# EAGLE board pcb (1) (EAGLE 9.6.2)
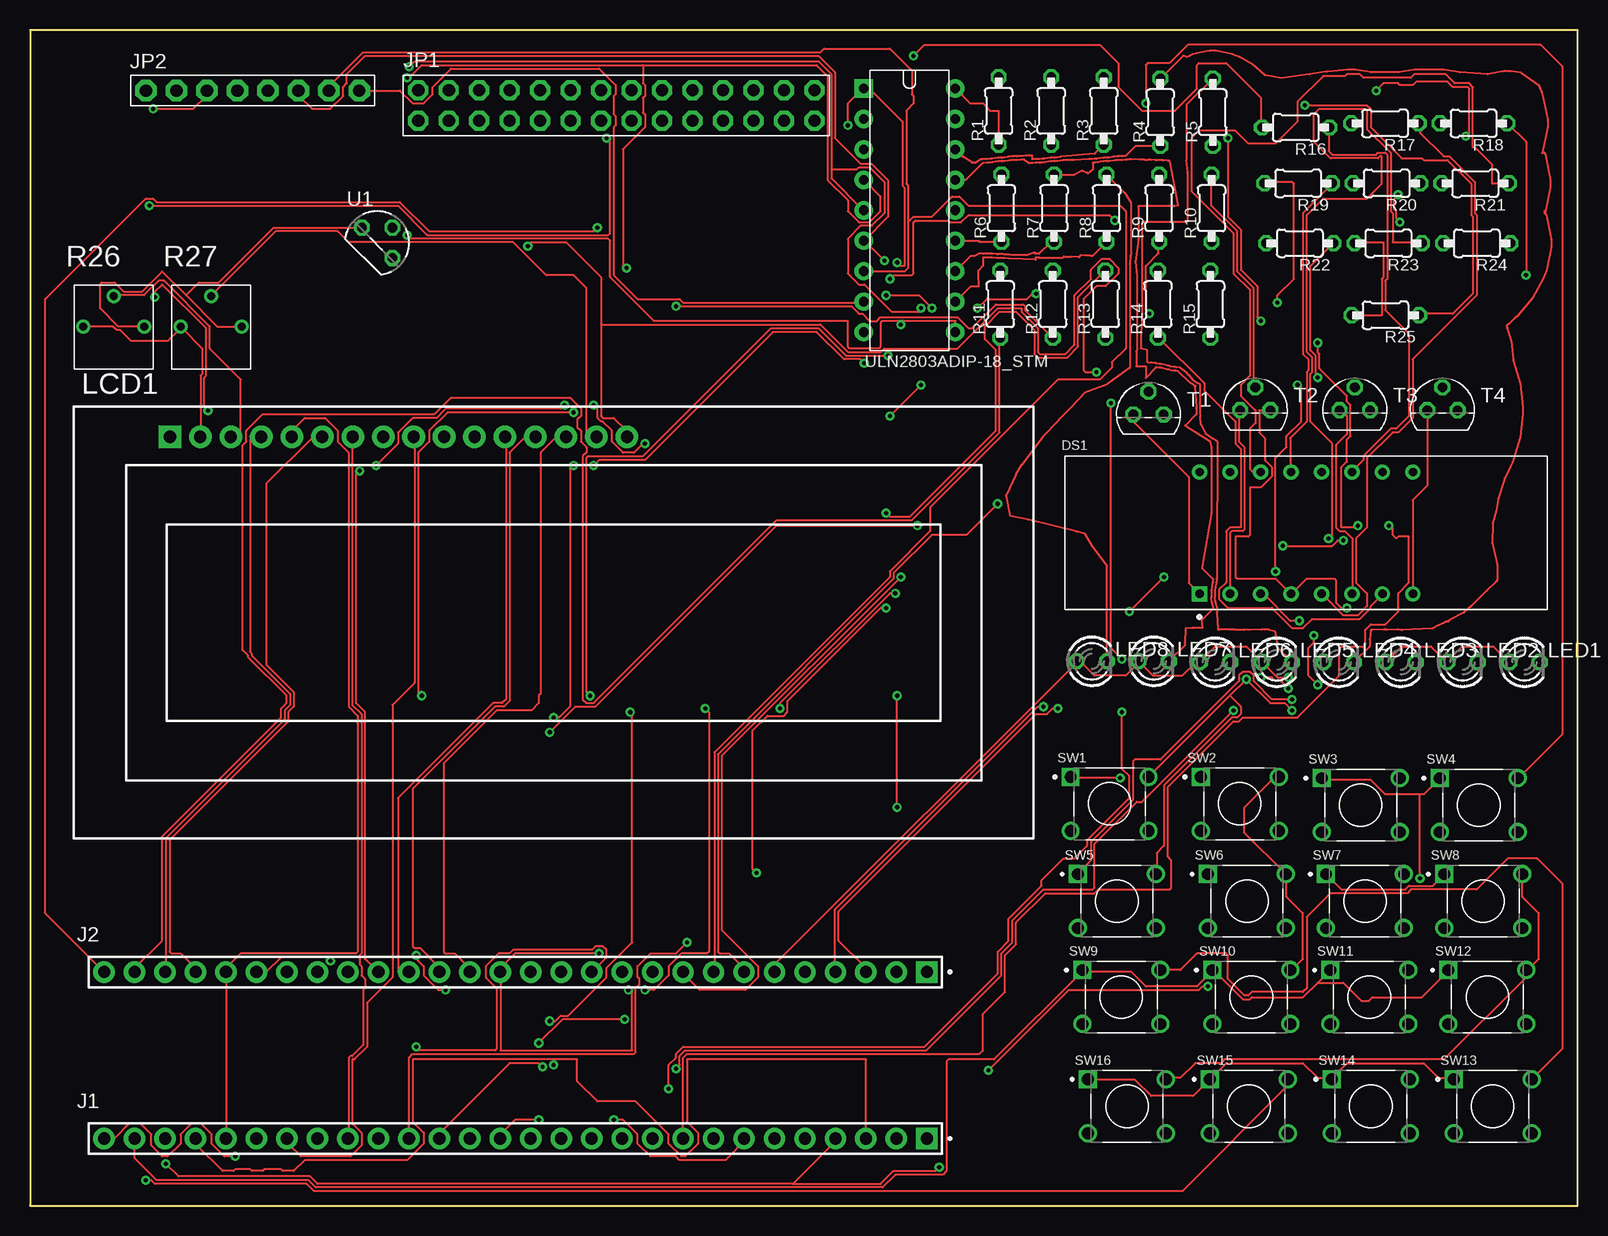
[diagram p1: board, top side]
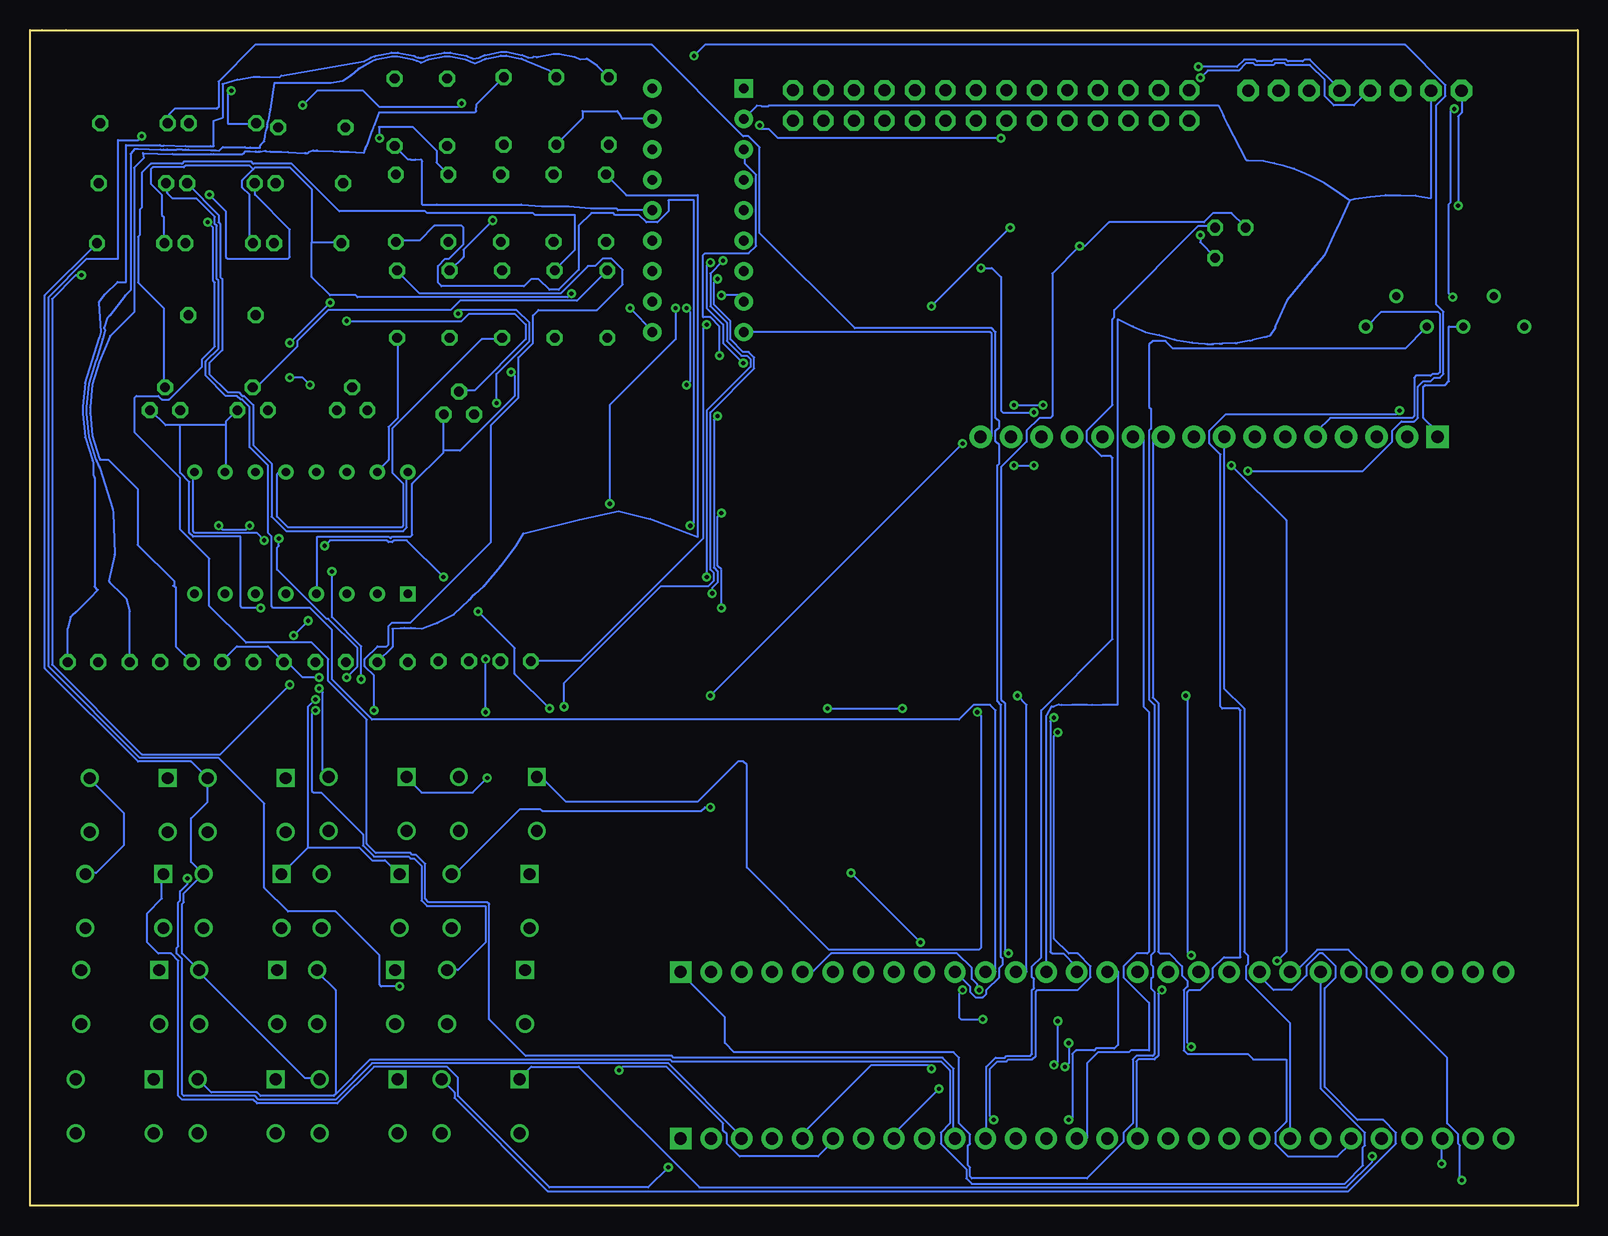
[diagram p2: board, bottom side, seen from below]

Size 129 x 98 mm. Coordinates in mm from the lower left corner, seen from the top.
Outline: 128,98 126,98 0,98 0,0 129,0 129,98 128,98
Copper layers (1*16): Top 0.035mm / dielectric 1.5mm / Bottom 0.035mm
Design rules "default": minimum track width 6mil, minimum drill 0.35mm, track to track 6mil, track to pad 6mil, pad to pad 6mil, via to via 6mil, smd to smd 6mil, copper to edge 40mil, drill to drill 6mil, minimum pad ring 10mil, minimum via ring 8mil, stop-mask expansion 4mil, vias tented up to drill 0mil, thermal gap 10mil

## Footprints (pad centres in the part's own frame; a part is rotated, then mirrored left to right if it is on the bottom)
DISPLAY_TDCG1060M = drill 0.7 pad 1.27 square: 1 -8.89,-5.08 | drill 0.7 pad 1.27: 2 -6.35,-5.08; 3 -3.81,-5.08; 4 -1.27,-5.08; 5 1.27,-5.08; 6 3.81,-5.08; 7 6.35,-5.08; 8 8.89,-5.08; 9 8.89,5.08; 10 6.35,5.08; 11 3.81,5.08; 12 1.27,5.08; 13 -1.27,5.08; 14 -3.81,5.08; 15 -6.35,5.08; 16 -8.89,5.08
DIP-18_STM = drill 0.813 pad 1.524 square: 1 0,0 | drill 0.813 pad 1.524: 2 0,-2.54; 3 0,-5.08; 4 0,-7.62; 5 0,-10.16; 6 0,-12.7; 7 0,-15.24; 8 0,-17.78; 9 0,-20.32; 10 7.62,-20.32; 11 7.62,-17.78; 12 7.62,-15.24; 13 7.62,-12.7; 14 7.62,-10.16; 15 7.62,-7.62; 16 7.62,-5.08; 17 7.62,-2.54; 18 7.62,0
SAMTEC_SS-128-T-2 = drill 1.016 pad 1.778 square: 01 0,0 | drill 1.016 pad 1.778: 02 -2.54,0; 03 -5.08,0; 04 -7.62,0; 05 -10.16,0; 06 -12.7,0; 07 -15.24,0; 08 -17.78,0; 09 -20.32,0; 10 -22.86,0; 11 -25.4,0; 12 -27.94,0; 13 -30.48,0; 14 -33.02,0; 15 -35.56,0; 16 -38.1,0; 17 -40.64,0; 18 -43.18,0; 19 -45.72,0; 20 -48.26,0; 21 -50.8,0; 22 -53.34,0; 23 -55.88,0; 24 -58.42,0; 25 -60.96,0; 26 -63.5,0; 27 -66.04,0; 28 -68.58,0
2X14-BIG = drill 1.016 pad 1.676 octagon: 1 -16.51,-1.27; 2 -16.51,1.27; 3 -13.97,-1.27; 4 -13.97,1.27; 5 -11.43,-1.27; 6 -11.43,1.27; 7 -8.89,-1.27; 8 -8.89,1.27; 9 -6.35,-1.27; 10 -6.35,1.27; 11 -3.81,-1.27; 12 -3.81,1.27; 13 -1.27,-1.27; 14 -1.27,1.27; 15 1.27,-1.27; 16 1.27,1.27; 17 3.81,-1.27; 18 3.81,1.27; 19 6.35,-1.27; 20 6.35,1.27; 21 8.89,-1.27; 22 8.89,1.27; 23 11.43,-1.27; 24 11.43,1.27; 25 13.97,-1.27; 26 13.97,1.27; 27 16.51,-1.27; 28 16.51,1.27
1X08-BIG = drill 1.016 pad 1.778 octagon: 1 -8.89,0; 2 -6.35,0; 3 -3.81,0; 4 -1.27,0; 5 1.27,0; 6 3.81,0; 7 6.35,0; 8 8.89,0
LCD-16X2_NOHOLESNOSILK = drill 1.016 pad 1.88 square: 1 -32,15.5 | drill 1.016 pad 1.88: 2 -29.46,15.5; 3 -26.92,15.5; 4 -24.38,15.5; 5 -21.84,15.5; 6 -19.3,15.5; 7 -16.76,15.5; 8 -14.22,15.5; 9 -11.68,15.5; 10 -9.14,15.5; 11 -6.6,15.5; 12 -4.06,15.5; 13 -1.52,15.5; 14 1.02,15.5; 15 3.56,15.5; 16 6.1,15.5
LED3MM = drill 0.813 octagon: A -1.27,0; K 1.27,0
0207/10 = drill 0.813 octagon: 1 -1.54,0; 2 4.08,0
3362P-1-103LF = drill 0.66: 1 -2.54,0; 2 0,2.54; 3 2.54,0
TE_1825910-2 = drill 0.99 square: 1 0,0 | drill 0.99: 2 6.5,0; 3 0,-4.5; 4 6.5,-4.5
TO92 = drill 0.813 octagon: 1 1.27,0; 2 0,1.905; 3 -1.27,0
TO92/ = drill 0.813 octagon: 1 1.27,-1.27; 2 1.27,1.27; 3 -1.27,1.27

## Placement (x,y rotation side)
DS1  TDCG1060M  [DISPLAY_TDCG1060M]  106.39,56.07 0 top
IC1  ULN2803ADIP-18_STM  [DIP-18_STM]  69.51,93.13 0 top
J1  SS-128-T-2  [SAMTEC_SS-128-T-2]  74.76,5.58 0 top
J2  SS-128-T-2  [SAMTEC_SS-128-T-2]  74.76,19.47 0 top
JP1  [2X14-BIG]  48.88,91.71 0 top
JP2  [1X08-BIG]  18.56,92.95 0 top
LCD1  LCD-16X2NOHOLES  [LCD-16X2_NOHOLESNOSILK]  43.66,48.59 0 top
LED1  [LED3MM]  124.58,45.3 0 top
LED2  [LED3MM]  119.42,45.3 0 top
LED3  [LED3MM]  114.26,45.3 0 top
LED4  [LED3MM]  109.1,45.3 0 top
LED5  [LED3MM]  103.94,45.3 0 top
LED6  [LED3MM]  98.78,45.3 0 top
LED7  [LED3MM]  93.68,45.38 0 top
LED8  [LED3MM]  88.52,45.38 0 top
R1  R-US  [0207/10]  80.75,89.98 90 top
R2  R-US  [0207/10]  85.13,89.98 90 top
R3  R-US  [0207/10]  89.51,89.98 90 top
R4  R-US  [0207/10]  94.22,89.87 90 top
R5  R-US  [0207/10]  98.6,89.87 90 top
R6  R-US  [0207/10]  80.98,81.87 90 top
R7  R-US  [0207/10]  85.36,81.87 90 top
R8  R-US  [0207/10]  89.74,81.87 90 top
R9  R-US  [0207/10]  94.12,81.87 90 top
R10  R-US  [0207/10]  98.5,81.87 90 top
R11  R-US  [0207/10]  80.88,73.87 90 top
R12  R-US  [0207/10]  85.26,73.87 90 top
R13  R-US  [0207/10]  89.64,73.87 90 top
R14  R-US  [0207/10]  94.02,73.87 90 top
R15  R-US  [0207/10]  98.4,73.87 90 top
R16  R-US  [0207/10]  106.78,89.87 180 top
R17  R-US  [0207/10]  114.22,90.22 180 top
R18  R-US  [0207/10]  121.6,90.22 180 top
R19  R-US  [0207/10]  106.98,85.22 180 top
R20  R-US  [0207/10]  114.36,85.22 180 top
R21  R-US  [0207/10]  121.74,85.22 180 top
R22  R-US  [0207/10]  107.12,80.22 180 top
R23  R-US  [0207/10]  114.5,80.22 180 top
R24  R-US  [0207/10]  121.88,80.22 180 top
R25  R-US  [0207/10]  114.26,74.22 180 top
R26  [3362P-1-103LF]  6.99,73.26 0 top
R27  [3362P-1-103LF]  15.1,73.26 0 top
SW1  1825910-2  [TE_1825910-2]  86.75,35.74 0 top
SW2  1825910-2  [TE_1825910-2]  97.59,35.74 0 top
SW3  1825910-2  [TE_1825910-2]  107.68,35.63 0 top
SW4  1825910-2  [TE_1825910-2]  117.52,35.63 0 top
SW5  1825910-2  [TE_1825910-2]  87.36,27.63 0 top
SW6  1825910-2  [TE_1825910-2]  98.2,27.63 0 top
SW7  1825910-2  [TE_1825910-2]  108.04,27.63 0 top
SW8  1825910-2  [TE_1825910-2]  117.88,27.63 0 top
SW9  1825910-2  [TE_1825910-2]  87.72,19.63 0 top
SW10  1825910-2  [TE_1825910-2]  98.56,19.63 0 top
SW11  1825910-2  [TE_1825910-2]  108.4,19.63 0 top
SW12  1825910-2  [TE_1825910-2]  118.24,19.63 0 top
SW13  1825910-2  [TE_1825910-2]  118.68,10.52 0 top
SW14  1825910-2  [TE_1825910-2]  108.52,10.52 0 top
SW15  1825910-2  [TE_1825910-2]  98.36,10.52 0 top
SW16  1825910-2  [TE_1825910-2]  88.2,10.52 0 top
T1  BC547  [TO92]  93.24,65.95 0 top
T2  BC547  [TO92]  102.14,66.3 0 top
T3  BC547  [TO92]  110.44,66.3 0 top
T4  BC547  [TO92]  117.74,66.3 0 top
U1  LM60CIZ  [TO92/]  28.94,80.26 0 top

## Tracks (layer width: path | path; a pad name or v marks a point on that pad's centre or on a via)
GND  (via drill 0.35)
  Top 0.152: v42.41,7.14 40.43,7.14 39.22,5.92 39.22,5.62 J1.15 | v49.88,17.96 50.03,17.96 50.19,17.81 50.19,12.94 39.22,12.94 39.22,19.34 J2.15 39.22,19.49 39.22,19.79 40.43,21.01 v47.44,21.01 | T2.1 103.38,66.28 102.46,66.28 102.46,64.45 102.92,63.99 102.92,62.16 103.53,61.55 103.53,60.79 102.61,59.87 101.7,59.87 101.7,55.91 101.55,55.76 100.48,55.76 100.48,52.41 100.63,52.25 103.83,52.25 105.05,51.03 DS1.4 105.2,51.03 106.42,52.25 108.71,52.25 108.86,52.1 108.86,50.27 109.32,49.82 v109.78,49.82 | J1.24 16.36,5.62 16.36,19.34 J2.24 16.36,19.49 16.36,19.79 17.57,21.01 27.18,21.01 27.33,21.16 27.33,40.82 26.57,41.59 26.57,62.77 25.65,63.68 25.65,64.6 24.58,65.67 22.91,65.67 21.84,64.6 21.84,64.14 LCD1.5 | 13,75.88 11.02,77.86 9.34,76.18 7.82,76.18 7.06,76.94 5.99,76.94 5.84,76.79 5.84,74.81 7.36,73.29 9.5,73.29 R26.3 | 13,75.88 15.59,73.29 17.57,73.29 R27.3 | 13,75.88 14.07,76.94 15.75,76.94 20.32,81.52 27.63,81.52 U1.3 | 47.6,73.44 47.6,77.4 44.7,80.3 41.81,80.3 v41.5,79.99 | 47.6,73.44 47.6,65.82 47.75,65.67 48.66,65.67 49.73,64.6 49.73,64.14 LCD1.16 | v88.9,69.48 87.98,69.48 87.83,69.63 87.83,75.57 88.9,76.64 89.66,76.64 90.73,77.7 90.73,78.16 89.96,78.92 89.35,78.92 88.44,78.01 88.44,77.25 87.07,75.88 87.07,71.76 86.31,71 84.17,71 84.02,71.15 84.02,73.13 82.65,74.5 82.65,74.81 80.67,74.81 77.31,71.46 71.22,71.46 70.91,71.15 68.17,71.15 65.89,73.44 47.6,73.44
  Bottom 0.152: v42.41,7.14 42.26,7.14 42.11,7.3 42.11,12.63 41.81,12.94 40.28,12.94 40.13,13.09 38.6,13.09 38.3,13.39 38.3,19.49 39.06,19.49 J2.15 | v49.88,17.96 50.03,18.12 50.03,18.42 50.49,18.88 50.49,19.79 51.71,21.01 62.23,21.01 63.75,19.49 64.51,19.49 J2.05 | 112.67,65.06 112.67,65.36 111.76,66.28 T3.1 | 112.67,65.06 112.67,61.25 DS1.10 | 112.67,65.06 116.48,65.06 | 116.48,65.06 117.7,65.06 118.92,66.28 T4.1 | 94.54,62.92 94.54,62.77 97.13,60.18 97.13,55.91 97.28,55.76 98.8,55.76 98.96,55.61 99.11,55.76 105.05,55.76 105.05,51.03 DS1.4 | 94.54,62.92 94.54,65.82 T1.1 | 116.48,65.06 116.48,61.09 115.72,60.33 115.72,56.06 115.42,55.76 111.45,55.76 111.45,49.97 111.3,49.82 v109.78,49.82 | IC1.9 69.39,72.83 48.97,72.83 48.82,72.68 48.82,64.14 49.73,64.14 LCD1.16 | R26.3 9.65,73.29 10.72,73.29 10.72,68.71 11.02,68.41 12.7,68.41 12.85,68.26 12.85,65.67 11.78,64.6 11.78,64.14 LCD1.1 | LCD1.5 21.69,64.14 21.69,64.6 20.62,65.67 13.76,65.67 13.61,65.82 13.61,69.02 13.46,69.17 12.24,69.17 12.09,69.32 11.63,69.32 11.48,69.48 11.48,74.35 11.63,74.5 16.36,74.5 17.57,73.29 R27.3 | U1.3 27.79,81.67 28.85,82.73 30.38,82.73 31.14,81.97 39.06,81.97 41.04,79.99 v41.5,79.99 43.79,77.7 43.79,65.82 43.94,65.67 44.85,65.67 45.92,64.6 45.92,63.68 48.05,61.55 48.05,42.2 47.75,41.89 47.75,21.16 47.6,21.01 v47.44,21.01 | 94.54,62.92 93.16,62.92 88.59,67.49 88.59,69.17 v88.9,69.48
LCD_8K
  Top 0.152: R27.2 15.14,75.88 20.47,81.21 25.65,81.21 26.57,80.3 40.28,80.3 43.02,77.55 45.31,77.55 46.38,76.49 46.38,64.14 47.14,64.14 LCD1.15
N$1
  Top 0.152: R8.2 91.28,84.41 91.78,83.61 91.78,79.78 91.75,79.22 91.72,79.18 91.68,78.5 91.68,69.87 91.65,69.8 89.81,68.46 89.78,68.45 89.6,68.38 89.52,68.34 88.28,67.89 87.92,67.76 86.73,66.5 86.33,66.06 85.75,65.46 85.67,65.38 84.54,64.2 84.45,64.11 82.69,61.77 82.2,60.94 81.38,59.24 81.35,59.19 81.71,57.5 83.19,57.17 87.25,56.18 87.89,56.04 88.52,54.98 89.79,53.32 LED8.K
N$2
  Top 0.152: R7.2 87.08,85.95 87.7,86.28 88.13,86.11 88.17,86.04 88.58,86.33 88.58,86.93 88.8,86.95 88.98,86.97 89.26,87.02 89.47,87.04 89.79,87.04 90.04,87.07 90.31,87.12 90.48,87.14 90.69,87.16 90.72,87.16 91.03,87.16 91.08,87.16 91.32,87.18 91.53,87.19 91.7,87.21 91.76,87.24 91.76,87.23 92.49,87.2 92.88,87.19 93.27,87.19 93.46,87.18 93.85,87.14 93.95,87.14 94.39,87.14 94.49,87.14 94.88,87.1 94.97,87.09 95.69,83.35 95.4,83.29 92.39,83.29 92.39,80.51 92.14,78.69 92.29,77.5 92.29,71.38 92.23,71.19 92.23,69.97 93,69.97 93,69 93.86,69.86 93.86,69.91 94.13,69.87 94.26,69.85 94.82,69.71 94.99,69.68 95.32,69.62 95.49,69.59 95.69,69.57 96.69,68.62 96.81,68.54 96.94,68.47 97.18,68.32 97.1,68.25 97.22,66.55 97.23,66.42 97.23,66.25 97.23,66.22 97.23,66.02 97.23,65.97 96.3,65.03 98.33,63.75 98.47,63.17 98.47,57.72 97.7,53.16 98.62,52.24 98.59,51.99 98.57,51.85 98.53,51.69 98.47,51.27 98.47,50.7 98.53,50.29 98.57,50.13 98.59,49.99 98.62,49.74 97.71,48.83 97.77,48.16 97.24,48.16 96.86,48.14 96.31,48.09 96.27,46.93 96.27,46.7 LED7.K
N$3
  Bottom 0.152: R6.2 79.32,84.29 79.32,84.24 73.32,84.24 73.32,55.75 75.92,56.71 77.13,57.18 77.28,57.24 79.92,57.89 83.19,57.17 87.25,56.18 87.89,56.04 88.52,54.98 89.79,53.32 91.1,51.71 91.2,51.62 91.89,50.99 92.14,50.77 92.41,50.49 93.68,49.26 94.68,48.75 94.95,48.63 95.08,48.57 95.22,48.51 96.31,48.09 96.86,48.14 97.24,48.16 97.78,48.16 98.14,48.14 98.78,48.09 98.78,46.57 LED6.K
N$4
  Top 0.152: 98.01,64.31 97.59,65.13 97.55,65.67 97.55,65.81 97.54,65.98 97.54,66.02 97.54,66.22 97.54,66.26 97.53,66.43 97.53,66.57 97.5,66.93 97.5,68.48 97.45,68.51 97.33,68.58 96.97,68.8 96.93,68.83 96.55,69.26 96.38,69.46 95.88,69.86 95.53,69.89 95.38,69.92 95.05,69.98 94.89,70.01 94.32,70.15 94.18,70.17 93.91,70.21 93.76,70.23 93.53,70.25 93.4,70.27 93.13,70.32 93.13,71.31 92.59,71.44 92.59,72.83 92.69,73.46 92.69,81.99 96.4,81.99 96.46,82.02 96.46,86.14 96.36,87.14 96.41,87.22 96.41,91.76 R5.2 | LED5.K 103.94,46.57 103.94,46.92 103.77,47.88 103.75,47.89 103.26,48.02 102.97,48.01 102.65,48.01 102.62,48.01 101.67,47.99 101.52,47.99 101.27,48.01 101.26,48.02 100.4,48.01 100.22,48.01 100.05,48.01 99.13,48.01 99.04,48.01 98.96,49.38 98.96,49.46 98.94,49.7 98.92,49.78 98.89,50.03 98.87,50.19 98.82,50.35 98.77,50.73 98.77,51.25 98.82,51.62 98.87,51.79 98.89,51.95 98.92,52.2 98.94,52.28 98.96,53.66 98.97,63.7 98.6,63.94 98.45,64.03 98.01,64.31 | 98.01,64.31
N$5
  Top 0.152: 118.33,48.79 118.22,48.68 118.08,48.68 117.95,48.62 117.94,48.62 117.82,48.56 117.57,48.44 117.45,48.39 116.88,48.08 114.37,47.96 114.32,47.96 114.08,48.02 114.02,48.04 113.11,48.01 113.01,48.01 112.86,48.01 111.83,47.96 111.76,47.96 111.68,47.19 111.68,46.61 LED4.K | R4.2 96.14,95.87 96.41,95.76 96.68,95.87 96.95,95.98 98.33,96.27 98.87,96.27 100.25,95.98 100.52,95.87 100.79,95.76 101.88,95.15 102.96,94.23 102.97,94.23 104.31,94 106.66,94.3 108.02,94.53 108.17,94.53 109.47,94.67 109.85,94.71 110.44,94.71 111.8,94.46 114.1,94.46 115.46,94.71 116.04,94.71 116.35,94.69 116.93,94.69 117.24,94.71 117.82,94.71 119.18,94.46 121.5,94.31 122.85,94.56 123.42,94.56 124.29,94.44 125.73,93.43 125.84,93.23 125.89,93.08 126.01,92.81 126.07,92.66 126.51,90.51 126.51,89.93 126.07,87.78 126.06,87.75 126.24,87.79 126.3,87.65 126.74,85.53 126.74,84.92 126.3,82.79 126.27,82.72 126.25,82.9 126.25,82.89 126.31,82.75 126.38,82.59 126.81,80.53 126.81,79.92 126.38,77.85 126.31,77.69 126.2,77.41 126.13,77.26 125.25,75.69 123.92,74.12 123.77,73.98 123.26,73.47 123.08,73.29 123.13,73.17 123.12,73.11 123.13,73.13 123.19,72.99 123.47,72.08 123.63,70.5 123.65,70.46 124.25,68.52 124.45,66.58 124.45,66.02 124.25,64.08 123.65,62.14 123.59,62 123.47,61.73 123.42,61.58 122.93,60.62 122.39,58.95 122.24,57.94 121.93,56.9 121.88,55.21 122.3,53.41 122.3,52.16 122.21,52.03 121.45,51.26 121.25,51.07 120.92,50.76 120.86,50.69 120.13,49.99 119.53,49.42 118.33,48.79 | 118.33,48.79
N$6
  Bottom 0.152: 122.31,72.48 | R3.2 91.81,91.76 91.81,91.54 91.81,91.25 91.92,91.14 99.88,91.14 100.25,90.14 100.3,90.03 100.36,89.87 100.47,89.6 100.83,88.6 100.94,88.33 101,88.17 101.05,88.06 101.16,87.76 101.83,87.81 102.41,87.84 102.56,87.85 102.75,87.85 102.8,87.85 103.03,87.85 103.16,87.86 103.69,87.88 105.03,87.95 105.12,87.95 105.37,87.95 105.41,87.95 105.78,87.81 105.83,87.76 105.8,87.75 105.84,87.75 105.99,87.75 106.09,87.75 107.5,87.81 108.03,87.84 108.18,87.85 108.37,87.85 108.59,87.85 108.98,87.87 109.35,87.9 109.43,87.93 109.8,87.86 109.91,87.87 110.17,87.87 110.21,87.87 110.66,87.88 111.04,87.9 111.29,87.65 113.69,87.65 113.7,87.66 113.93,87.66 117.1,87.66 119.59,87.73 119.52,87.31 120.32,86.52 120.32,74.48 122.31,72.48 | LED3.K 116.84,46.61 116.84,51.56 117.08,51.68 116.96,51.68 116.96,52 120.03,55.08 120.03,59.74 122.47,62.17 123.17,62.17 123.22,62.3 123.8,64.17 123.99,66.04 123.99,66.56 123.8,68.43 123.22,70.3 122.31,72.48
N$7
  Bottom 0.152: 120.62,87.68 120.62,76.31 121.07,75.86 122.36,74.19 122.54,73.97 122.82,73.19 122.82,73.13 122.71,72.96 122.76,72.84 122.94,72.23 123.49,70.45 123.5,70.41 124.1,68.49 124.3,66.57 124.3,66.03 124.1,64.11 123.5,62.19 123.45,62.06 123.33,61.78 123.28,61.65 123.21,61.51 122.11,58.07 122.09,57.97 122.05,57.82 121.94,54.29 121.95,54.27 122.42,52.06 122.33,51.94 121.33,50.94 121.24,50.85 121.03,50.65 120.97,50.58 120.69,49.52 LED2.K | 120.62,87.68 120.28,88.09 120.02,88.09 118.11,88.04 117.88,88.03 117.59,88.03 117.56,88.03 117.14,88.01 116.96,88.01 116.8,88.01 116.76,88.02 116.33,88.03 116.03,88.03 115.8,88.03 113.92,87.97 113.69,87.96 113.5,87.96 113.22,87.96 112.92,88.25 111.08,88.25 111.03,88.2 110.65,88.19 110.61,88.19 109.91,88.17 109.84,88.17 109.77,88.42 109.46,88.73 109.41,89.1 109.41,89.17 109.36,89.44 109.33,89.6 109.27,89.74 109.25,89.87 109.23,89.95 109.23,90.14 109.21,90.22 109.19,90.35 109.13,90.49 109.1,90.65 109.06,90.92 109.06,90.99 109,91.36 108.64,93.6 103.93,93.6 102.94,93.77 102.24,94.24 101.61,94.77 100.59,95.34 100.48,95.39 100.21,95.5 100.11,95.54 98.83,95.81 98.37,95.81 97.09,95.54 96.99,95.5 96.79,95.42 96.41,95.26 96.03,95.42 95.83,95.5 95.73,95.54 94.45,95.81 93.99,95.81 92.71,95.54 92.61,95.5 92.28,95.37 91.91,95.21 91.33,95.46 91.07,95.57 90.97,95.61 89.74,95.86 89.28,95.86 88.05,95.61 87.95,95.57 87.65,95.45 85.71,94.64 R2.2 | 120.62,87.68
N$8
  Bottom 0.152: R1.2 81.76,95.07 82.59,95.62 82.67,95.59 83.14,95.55 83.22,95.59 83.51,95.71 83.62,95.75 84.89,96.02 85.37,96.02 86.64,95.75 86.75,95.71 87.03,95.76 87.1,95.73 87.46,95.69 87.54,95.73 87.83,95.85 87.95,95.9 89.25,96.17 89.77,96.17 91.06,95.9 91.19,95.85 91.45,95.74 91.59,95.68 92.07,95.61 92.17,95.65 92.5,95.78 92.62,95.84 93.96,96.11 94.48,96.11 95.82,95.84 95.94,95.78 96.15,95.7 96.22,95.67 96.6,95.67 96.67,95.7 96.88,95.78 97,95.84 98.34,96.11 98.86,96.11 100.2,95.84 100.32,95.78 100.6,95.67 100.73,95.62 101.14,95.39 108.04,94.2 108.17,94.08 109.84,94.09 109.88,94.1 110.39,94.1 111.7,93.86 112.95,93.49 112.95,90.67 113.68,90.42 113.68,88.32 113.97,88.33 116.02,88.33 117.82,88.39 117.87,88.34 118.1,88.34 118.16,88.4 121,88.4 121,77 121.7,77 122.71,75.99 123.25,75.29 123.1,72.81 123.09,72.81 123.23,72.32 123.24,72.31 124.4,68.55 124.6,66.59 124.6,66.01 124.4,64.05 123.79,62.09 123.73,61.94 123.73,60.94 123.61,60.67 123.61,51.61 123.34,51.33 123.47,51.2 123.86,50.77 125.16,49.47 125.47,49.2 125.6,49.06 125.85,48.12 LED1.K
N$9
  Top 0.152: DS1.1 96.58,51.91 96.58,60.72 92.1,65.21 92.1,65.82 T1.3
N$10
  Top 0.152: IC1.18 78.4,91.86 79.47,91.86 80.06,91.25 80.75,91.25 R1.1
N$11
  Bottom 0.152: R2.1 82.94,90.63 82.94,91.25 80.06,91.25 79.81,90.91 79.63,90.59 IC1.17
N$12
  Top 0.152: R3.1 88.75,87.68 | 88.75,87.68 | 78.84,86.93 79.27,87.22 79.32,87.23 79.33,87.23 79.42,87.23 79.46,87.23 79.77,87.23 79.8,87.23 80.01,87.25 80.18,87.27 80.45,87.32 80.7,87.35 81.02,87.35 81.23,87.37 81.51,87.42 81.69,87.44 81.91,87.46 81.95,87.46 82.26,87.46 82.3,87.47 82.54,87.48 82.74,87.49 83.01,87.53 83.55,87.53 83.55,87.21 83.8,87.23 83.84,87.23 84.15,87.23 84.18,87.23 84.39,87.25 84.56,87.27 84.83,87.32 85.08,87.35 85.4,87.35 85.61,87.37 85.89,87.42 88.75,87.68 | 78.84,86.93 78.69,86.93 78.55,86.93 77.75,87.43 IC1.16 | 78.84,86.93
N$13
  Top 0.152: IC1.15 78.02,85.51 79.4,86.89 | R4.1 92.15,88.33 91.3,87.48 91.06,87.47 91.02,87.46 90.71,87.46 90.67,87.46 90.45,87.44 90.27,87.42 89.99,87.37 89.78,87.35 89.46,87.35 89.21,87.32 88.94,87.27 88.77,87.25 88.56,87.23 88.53,87.23 88.22,87.23 87.03,87.16 86.34,87.16 86.31,87.16 86.1,87.14 85.93,87.12 85.66,87.07 85.41,87.04 85.09,87.04 84.88,87.02 84.6,86.97 84.42,86.95 84.2,86.93 84.16,86.93 83.85,86.93 83.81,86.92 83.57,86.91 83.37,86.9 83.28,86.89 82.92,87.11 82.87,87.2 82.77,87.19 82.56,87.18 82.31,87.16 82.27,87.16 81.96,87.16 81.93,87.16 81.72,87.14 81.55,87.12 81.28,87.07 81.03,87.04 80.71,87.04 80.5,87.02 80.22,86.97 80.03,86.95 79.82,86.93 79.4,86.89 | 79.4,86.89
N$14
  Bottom 0.152: R5.1 97.46,87.19 97.26,87.19 96.87,87.2 96.41,87.22 96.31,87.06 96.31,83.45 95.09,83.44 88.03,83.44 86.33,83.29 84.08,83.29 82.26,83.14 80.12,83.14 80,82.97 IC1.14
N$15
  Top 0.152: R6.1 79.11,80.33 79.11,80.43 IC1.13
N$16
  Top 0.152: R7.1 85.11,80.33 84.12,79.34 83.83,79.34 83.71,79.46 83.06,79.24 81.84,79.24 81.65,79.25 81.26,79.29 81.16,79.29 80.71,79.29 80.62,79.3 80.23,79.33 80.03,79.34 79.74,79.34 79.45,79.34 79.44,79.35 79.1,79.36 78.71,79.16 78.4,79.16 IC1.12
N$17
  Top 0.152: R8.1 88.6,79.19 88.4,79.19 88.01,79.2 87.55,79.22 87.45,79.06 86.79,79.09 86.21,79.09 86.16,79.09 86.11,79.04 84.12,79.04 83.82,79.04 83.82,78.84 81.63,78.95 81.24,78.98 81.15,78.99 80.7,78.99 80.6,78.99 80.21,79.03 80.02,79.04 79.74,79.04 79.44,79.04 79.44,78.34 79.06,77.95 79.06,77.68 79.1,76.62 78.4,76.62 IC1.11
N$18  (via drill 0.35)
  Top 0.152: v102.61,73.74 102.31,74.05 102.31,76.64 100.94,78.01 100.94,81.36 99.87,82.43 v99.87,88.98
  Bottom 0.152: v102.61,73.74 93.01,73.74 92.4,74.35 88.59,74.35 87.68,73.44 87.68,72.22 91.94,67.95 93.16,67.95 T1.2 | v99.87,88.98 99.87,89.89 99.92,89.94 97.11,89.94 95.12,87.95 95.12,86.95 R9.2
N$19
  Top 0.152: R10.2 98.5,85.94 98.5,83.34 100.63,81.21 100.63,77.86 102,76.49 102,68.26 T2.2
N$20
  Bottom 0.152: R11.2 83.41,75.42 93.16,75.42 93.93,74.66 104.14,74.66 106.73,72.07 106.73,71.61 110.08,68.26 110.39,68.26 T3.2
N$22
  Top 0.152: DS1.2 100.02,51.03 100.02,56.06 100.17,56.22 101.09,56.22 101.24,56.37 101.24,63.23 100.78,63.68 100.78,66.28 T2.3
N$23
  Top 0.152: DS1.6 110.23,51.03 110.23,55.61 109.62,56.22 109.17,56.22 108.86,56.52 108.86,63.38 109.78,64.29 109.78,65.82 109.32,66.28 T3.3
N$24
  Top 0.152: DS1.8 115.26,51.03 115.26,58.81 116.48,60.03 116.48,66.28 T4.3
N$25
  Top 0.152: DS1.7 112.67,50.88 111.76,49.97 111.76,49.82 110.84,48.9 106.88,48.9 106.12,48.14 105.2,48.14 103.53,49.82 99.87,49.82 99.11,50.58 99.11,51.34 99.72,51.95 99.72,56.22 100.02,56.52 100.94,56.52 100.94,63.08 100.48,63.53 100.48,65.36 97.89,67.95 97.89,68.56 94.08,72.37 R14.1
N$26
  Bottom 0.152: DS1.15 100.02,61.25 99.11,62.16 99.11,64.9 98.35,65.67 98.35,72.22 R15.1
N$27
  Top 0.152: DS1.11 110.23,61.25 111.15,62.16 111.15,62.47 113.43,64.75 113.89,64.75 114.96,65.82 114.96,72.68 112.98,74.66 112.98,77.1 113.13,77.25 113.13,87.61 112.98,87.76 112.37,87.76 112.21,87.61 108.56,87.61 108.25,87.92 108.25,89.75 R16.1
N$28
  Top 0.152: DS1.5 107.8,50.88 109.47,49.21 110.69,49.21 111.45,49.97 111.45,51.03 110.54,51.95 110.54,55.61 111.45,56.52 111.45,62.31 113.59,64.45 114.04,64.45 115.26,65.67 115.26,70.54 120.6,75.88 120.6,82.58 120.44,82.73 120.44,85.33 118.31,87.46 117.85,87.46 115.87,89.44 115.87,90.2 R17.1
N$29  (via drill 0.35)
  Top 0.152: v105.81,48.75 105.05,48.75 102.92,50.88 102.61,50.88 DS1.3 | v107.03,47.53 107.03,46.92 106.58,46.46 106.58,44.18 v107.34,43.41 | v124.71,77.55 124.71,88.68 123.19,90.2 R18.1
  Bottom 0.152: v107.03,47.53 v105.81,48.75 | v107.34,43.41 113.13,37.62 119.68,37.62 127.15,45.09 127.15,75.57 125.17,77.55 v124.71,77.55
N$30
  Top 0.152: DS1.13 105.05,61.25 105.05,63.99 106.42,65.36 106.42,69.48 106.58,69.63 106.58,70.54 106.12,71 106.12,82.73 108.56,85.17 R19.1
N$31
  Bottom 0.152: DS1.16 97.58,61.09 97.58,56.52 97.89,56.22 107.64,56.22 108.86,57.44 108.86,61.86 110.39,63.38 110.39,66.73 111.15,67.49 111.3,67.49 111.61,67.8 112.52,67.8 114.04,69.32 114.04,70.24 112.98,71.3 112.98,77.25 113.13,77.4 113.13,81.82 113.28,81.97 113.28,82.58 115.87,85.17 R20.1
N$32
  Top 0.152: DS1.14 102.46,61.25 101.85,61.25 101.7,61.4 101.7,64.75 102.16,65.21 102.16,66.28 100.94,67.49 100.94,68.41 101.7,69.17 101.7,76.33 100.33,77.7 100.33,81.06 96.82,84.56 96.82,88.98 97.43,89.59 100.48,89.59 101.55,88.53 103.83,88.53 105.66,90.35 105.66,92.03 107.8,94.16 109.62,94.16 109.78,94.32 110.84,94.32 111.15,94.01 115.11,94.01 115.42,94.32 118.01,94.32 118.77,93.56 119.99,93.56 120.29,93.25 120.29,88.22 120.44,88.22 121.9,86.76 121.9,85.17 123.19,85.17 R21.1
N$33
  Bottom 0.152: T4.2 117.85,68.26 117.85,74.81 119.99,76.94 119.99,80.75 119.83,80.91 119.83,83.04 119.68,83.19 119.68,86.09 118.92,86.85 116.33,86.85 116.18,87 110.54,87 110.39,86.85 107.19,86.85 103.22,82.89 96.06,82.89 95.91,82.73 87.07,82.73 86.92,82.58 83.56,82.58 83.56,79.69 85.24,78.01 R12.2
N$41
  Bottom 0.152: DS1.12 107.8,61.09 108.25,61.09 108.4,60.94 108.4,57.44 107.49,56.52 98.04,56.52 97.89,56.67 97.89,60.18 98.8,61.09 98.8,64.75 91.34,72.22 89.66,72.22 R13.1
RA0  (via drill 0.35)
  Top 0.152: v68.17,90.05 68.17,91.88 69.39,93.1 IC1.1 69.54,93.1 70,93.1 72.74,90.35 72.74,85.02 72.89,84.87 72.89,78.31 72.44,78.31 72.29,78.47 v72.29,78.62 | v48.05,88.98 48.21,88.98 48.36,88.83 48.36,81.06 48.21,80.91 33.12,80.91 30.68,83.34 v9.95,83.34 | v43.63,40.67 44.09,40.67 45.01,41.59 45.01,61.4 v45.31,61.7 | v46.99,61.7 47.44,62.16 51.25,62.16 61.92,72.83 65.58,72.83 67.87,70.54 69.24,70.54 v69.54,70.24
  Bottom 0.152: v68.17,90.05 68.17,89.75 67.41,89.75 66.65,88.98 v48.05,88.98 | v9.95,83.34 9.95,90.81 9.65,91.12 9.65,92.94 JP2.1 | v43.63,40.67 43.94,40.37 43.94,21.16 43.79,21.01 42.87,21.01 41.81,19.95 41.81,19.49 J2.14 | v46.99,61.7 v45.31,61.7 | v69.54,70.24 71.22,71.91 71.22,73.44 72.59,74.81 72.59,78.31 v72.29,78.62
RA1
  Bottom 0.152: IC1.2 68.4,91.7 68.02,91.64 67.45,91.64 67.41,91.71 29.95,91.71 29.68,91.24 29.51,90.89 29.47,90.79 29.36,90.52 29.15,90.09 27.59,87.13 27.45,87.13 26.18,87.09 25.28,86.9 24.54,86.71 23.64,86.45 23.03,86.17 22.37,85.88 21.1,85.27 19.83,84.41 18.99,83.81 | JP2.2 12.21,84 13.48,84.19 14.75,84.22 15.1,84.22 16.02,84.23 17.29,84.1 18.56,83.92 18.99,83.81 | J2.13 44.28,40.84 43.84,41.6 43.63,41.61 43.21,41.75 43.01,41.75 42.14,41.75 41.74,41.76 40.87,41.76 40.47,41.75 39.6,41.75 39.2,41.76 38.33,41.76 38.33,73.88 37.06,73.28 36.27,72.93 36.03,72.82 34.87,72.57 34.67,72.51 33.6,72.19 33.4,72.14 32.32,71.97 32.14,71.94 31.05,71.84 30.88,71.82 30.47,71.81 30.34,71.82 29.83,71.83 29.64,71.84 28.54,71.9 28.36,71.91 27.31,72.1 27.12,72.14 26.05,72.4 25.86,72.45 25.66,72.5 25.65,72.5 25.21,73.2 25.18,73.26 24.97,73.75 24.17,75.49 23.04,76.89 22.22,77.84 21.08,79.24 20.28,80.98 20.04,81.53 18.99,83.81
RA2  (via drill 0.35)
  Top 0.152: v71.52,70.85 68.02,70.85 65.73,73.13 61.77,73.13 51.1,62.47 46.53,62.47 46.38,62.31 46.38,42.81 v46.68,42.5 | v10.26,91.42 13.61,91.42 14.68,92.49 14.68,92.94 JP2.3 | v10.41,75.72 10.41,76.18 11.02,76.79 14.68,73.13 14.68,69.17 14.53,69.02 14.53,66.58 v14.83,66.28 | v32.2,13.24 32.2,13.09 32.36,12.94 38.76,12.94 38.91,13.09 38.91,18.12 38,19.03 38,19.95 39.06,21.01 39.98,21.01 40.28,21.32 46.84,21.32 47.14,21.62 47.75,21.62 48.05,21.32 48.05,20.71 46.84,19.49 J2.12
  Bottom 0.152: v71.52,70.85 71.52,73.29 72.29,74.05 72.89,74.05 72.89,79.23 72.74,79.38 69.08,79.38 68.48,79.99 68.48,85.94 69.39,86.85 69.39,87.92 IC1.3 | v46.68,42.5 45.92,41.74 45.92,19.49 46.68,19.49 J2.12 | v10.26,91.42 10.41,91.42 10.56,91.27 10.56,83.65 10.72,83.5 10.72,76.03 v10.41,75.72 | v14.83,66.28 15.14,65.97 29.31,65.97 30.68,64.6 30.68,63.53 29.77,62.62 29.77,41.59 29.61,41.43 28.24,41.43 28.09,41.28 28.09,20.71 29.46,20.71 30.38,19.79 30.38,19.03 31.44,17.96 32.36,17.96 32.51,17.81 32.51,13.54 v32.2,13.24
RA3  (via drill 0.35)
  Top 0.152: IC1.4 70.91,84.11 70.91,82.89 70,81.97 69.08,81.97 68.17,82.89 68.17,83.8 66.49,85.48 66.49,94.16 65.58,95.08 51.1,95.08 | 51.1,95.08 32.66,95.08 31.59,94.01 v31.44,94.01 | v34.64,17.96 34.03,17.96 32.81,19.18 32.81,19.95 32.2,20.55 v32.2,20.86 | v32.66,42.5 32.51,42.5 32.36,42.65 32.36,62.77 33.27,63.68 33.27,64.6 34.8,66.12 v45.31,66.12 | v49.73,78.16 49.58,78.16 49.43,78.31 49.43,88.07 51.25,89.9 51.25,90.96 51.1,91.12 51.1,92.34 51.25,92.49 51.25,93.4 51.1,93.56 51.1,95.08
  Bottom 0.152: v31.44,94.01 30.83,94.62 28.24,94.62 27.63,95.23 27.02,95.23 26.87,95.08 25.35,95.08 25.19,95.23 24.43,95.23 24.28,95.08 22.3,95.08 21.08,93.86 21.08,92.49 20.32,91.73 18.64,91.73 17.42,92.94 JP2.4 | v34.64,17.96 34.95,17.66 34.95,12.48 35.25,12.17 36.62,12.17 36.78,12.02 36.78,5.62 J1.16 | v32.2,20.86 32.51,21.16 32.51,42.35 v32.66,42.5 | v45.31,66.12 47.9,66.12 48.05,66.28 48.05,77.4 48.82,78.16 v49.73,78.16
RA4  (via drill 0.35)
  Top 0.152: 66.8,86.39 66.8,94.32 65.73,95.38 32.05,95.38 v31.59,94.93 | 66.8,86.39 66.8,85.63 69.39,83.04 IC1.5 | v42.72,11.56 42.41,11.87 39.98,11.87 34.19,6.08 34.19,5.62 J1.17 | v42.41,13.54 44.4,15.53 v49.58,15.53 | v51.25,17.96 52.02,17.96 53.24,19.18 53.24,19.95 54.3,21.01 56.44,21.01 56.59,21.16 56.59,41.13 v56.28,41.43 | v62.53,41.43 62.53,41.89 71.68,51.03 v72.13,51.03 | v74.27,68.41 v71.68,65.82 | v74.27,74.81 74.27,74.66 74.11,74.5 71.83,74.5 69.54,76.79 69.08,76.79 68.17,77.7 68.17,80.6 69.24,81.67 70.15,81.67 71.22,82.73 71.22,85.33 70,86.54 69.08,86.54 68.93,86.39 66.8,86.39
  Bottom 0.152: v31.59,94.93 28.39,94.93 27.79,95.54 26.87,95.54 26.72,95.38 25.5,95.38 25.35,95.54 24.28,95.54 24.13,95.38 22.91,95.38 22.76,95.54 22.3,95.54 19.86,93.1 JP2.5 | v42.72,11.56 42.41,11.87 v42.41,13.54 | v49.58,15.53 51.41,15.53 51.56,15.68 51.56,17.66 v51.25,17.96 | v62.53,41.43 v56.28,41.43 | v72.13,51.03 72.13,51.49 71.68,51.95 71.68,52.86 71.98,53.17 71.98,65.51 v71.68,65.82 | v74.27,68.41 73.96,68.71 73.96,74.5 v74.27,74.81
RA5  (via drill 0.35)
  Top 0.152: 69.54,80.45 71.52,82.43 71.52,85.48 70.15,86.85 69.24,86.85 67.1,88.98 67.1,94.47 65.73,95.84 27.94,95.84 26.41,94.32 26.41,93.56 26.11,93.25 26.11,92.49 25.04,91.42 23.52,91.42 22.45,92.49 22.45,92.94 JP2.6 | v72.59,52.41 57.66,37.47 57.66,22.99 60.7,19.95 60.7,19.03 59.64,17.96 55.83,17.96 54.45,19.34 J2.09 | 69.54,80.45 v71.22,78.77 | 69.54,80.45 IC1.6
  Bottom 0.152: v72.59,52.41 72.59,66.28 68.93,69.93 68.93,70.54 69.24,70.85 69.69,70.85 70.91,72.07 70.91,73.59 72.29,74.96 72.29,77.7 v71.22,78.77
RA6
  Top 0.152: 73.2,81.97 73.2,85.02 73.05,85.17 73.05,91.27 73.66,91.88 73.66,92.49 73.5,92.64 73.5,94.62 71.68,96.45 66.19,96.45 65.89,96.15 27.79,96.15 25.04,93.4 25.04,93.1 JP2.7 | 73.2,81.97 73.2,78.16 72.89,77.86 69.54,77.86 IC1.7 | 73.2,81.97 73.66,82.43 75.18,82.43 76.86,84.11 77.47,84.11 78.23,83.34 90.88,83.34 91.34,82.89 91.34,71.46 90.18,70.3 90.18,69.85 89.2,68.87 85.7,68.87 75.03,58.2 75.03,56.22 71.68,52.86 71.68,52.41 57.05,37.78 57.05,19.49 J2.08
RA7  (via drill 0.35)
  Top 0.152: IC1.8 69.39,75.27 54.45,75.27 54.15,75.57 50.65,75.57 48.66,77.55 48.66,89.9 48.82,90.05 48.82,90.81 48.66,90.96 48.66,92.49 48.82,92.64 48.82,93.4 47.44,94.77 35.1,94.77 33.58,93.25 33.58,92.64 32.81,91.88 31.9,91.88 30.83,92.94 27.48,92.94 JP2.8 | v80.67,58.5 78.08,55.91 75.18,55.91 71.98,52.71 71.98,52.25 57.35,37.62 57.35,21.16 57.5,21.01 58.27,21.01 59.48,19.79 59.48,19.49 J2.07 | v75.18,74.81 74.11,75.88 v71.37,75.88
  Bottom 0.152: v80.67,58.5 80.67,66.73 75.18,72.22 v75.18,74.81 | v71.37,75.88 70,75.88 69.54,75.42 IC1.8
RB0
  Bottom 0.152: R21.2 117.55,85.17 117.55,84.41 117.09,83.95 115.11,83.95 113.59,82.43 113.59,81.82 113.43,81.67 113.43,77.25 113.28,77.1 113.28,71.46 114.35,70.39 114.35,69.17 112.67,67.49 111.76,67.49 111.45,67.19 111.3,67.19 110.69,66.58 110.69,63.23 109.17,61.7 109.17,56.06 108.86,55.76 108.86,49.97 108.71,49.82 105.66,49.82 103.83,47.99 103.83,43.87 100.48,40.52 51.56,40.52 50.34,41.74 48.97,41.74 48.51,41.28 48.51,19.49 49.27,19.49 J2.11
RB1  (via drill 0.35)
  Top 0.152: v114.04,84.26 113.74,83.95 113.74,83.04 113.89,82.89 113.89,82.28 v114.2,81.97
  Bottom 0.152: v114.04,84.26 112.67,82.89 112.67,79.08 112.52,78.92 107.49,78.92 107.34,79.08 107.34,81.36 110.23,84.26 110.23,85.17 R20.2 | v114.2,81.97 113.74,81.52 113.74,77.1 113.59,76.94 113.59,71.61 114.65,70.54 114.65,69.93 117.4,67.19 118.01,67.19 118.31,67.49 120.14,67.49 120.29,67.34 120.29,64.45 116.48,60.64 116.48,56.37 114.04,53.93 114.04,49.97 111,46.92 105.51,46.92 104.14,45.55 104.14,43.72 100.94,40.52 100.94,30.16 100.17,29.39 97.28,29.39 97.13,29.24 96.82,29.24 96.06,28.48 96.06,25.58 95.75,25.28 90.88,25.28 90.73,25.13 90.73,15.53 87.68,12.48 75.49,12.48 75.33,12.33 52.93,12.33 52.02,11.41 52.02,5.62 J1.10
RB2  (via drill 0.35)
  Top 0.152: v103.98,75.27 103.98,75.88 105.36,77.25 105.36,85.17 105.2,85.33 102.92,85.33 R19.2 | v107.34,71.91 107.34,71.15 107.49,71 107.49,69.78 109.78,67.49 109.78,67.04 110.08,66.73 110.08,64.14 109.78,63.84 109.78,62.01 109.32,61.55 109.32,56.52 110.54,56.52 v110.69,56.67 | v113.28,56.67 113.43,56.67 113.59,56.52 113.59,55.91 113.89,55.61 114.04,55.76 114.96,55.76 114.96,51.95 114.04,51.03 114.04,49.51 112.98,48.44 111.76,48.44 111.3,47.99 111.3,46.77 111.15,46.62 109.32,46.62 109.17,46.46 109.17,44.18 105.66,40.67 101.09,40.67 100.78,40.37 100.33,40.37 94.84,34.88 94.84,29.09 95.15,28.79 95.15,26.5 94.99,26.35 89.05,26.35 88.75,26.04 84.63,26.04 82.19,23.6 82.19,21.77 81.28,20.86 81.28,17.81 79.45,15.98 79.45,12.94 79.14,12.63 54.76,12.63 54.45,12.33 54.45,5.62 J1.09
  Bottom 0.152: v107.34,71.91 v103.98,75.27 | v110.69,56.67 111,56.37 112.98,56.37 v113.28,56.67
RB3
  Bottom 0.152: R18.2 117.4,90.35 117.4,90.96 116.94,91.42 113.43,91.42 113.28,91.57 113.28,93.71 110.23,96.75 77.16,96.75 69.54,89.14 69.08,89.14 68.17,88.22 68.17,81.06 60.25,73.13 48.82,73.13 48.51,72.83 48.51,65.67 48.21,65.36 48.21,64.9 48.51,64.6 48.51,63.68 48.21,63.38 48.21,61.86 48.36,61.7 48.36,42.04 48.05,41.74 48.05,20.71 47.9,20.55 47.9,20.1 48.21,19.79 48.21,19.03 49.27,17.96 49.27,17.66 49.58,17.36 50.19,17.36 50.65,17.81 50.65,18.27 51.86,19.49 J2.10
RB4  (via drill 0.35)
  Top 0.152: v112.21,92.94 112.82,93.56 114.04,93.56 114.2,93.4 115.26,93.4 115.57,93.71 118.16,93.71 118.61,93.25 119.83,93.25 119.99,93.1 119.99,89.44 v119.68,89.14 | v98.19,18.27 97.74,18.27 97.43,17.96 86.61,17.96 v79.91,11.26
  Bottom 0.152: v112.21,92.94 112.52,92.64 112.52,90.2 110.23,90.2 R17.2 | v119.68,89.14 119.99,88.83 121.66,88.83 121.66,78.92 124.25,78.92 127.45,75.72 127.45,44.94 119.83,37.32 113.28,37.32 109.47,33.51 109.47,26.5 107.49,24.52 103.53,24.52 99.87,20.86 99.87,18.42 99.72,18.27 v98.19,18.27 | v79.91,11.26 79.6,11.56 75.94,11.56 71.22,6.84 71.22,6.23 70.91,5.92 70.91,5.16 69.85,4.1 63.29,4.1 61.92,5.47 J1.06
RB5  (via drill 0.35)
  Top 0.152: v73.66,95.84 74.57,96.75 89.2,96.75 90.73,95.23 90.73,93.25 92.71,91.27 95.45,91.27 97.28,93.1 97.28,95.08 97.43,95.23 99.72,95.23 102.61,92.34 102.61,89.9 R16.2 | v27.48,61.25 27.18,60.94 27.18,41.89 27.94,41.13 27.94,20.55 29,19.49 J2.19
  Bottom 0.152: v73.66,95.84 72.74,96.75 14.37,96.75 11.02,93.4 11.02,92.49 11.78,91.73 11.78,75.11 11.17,74.5 11.17,69.32 11.48,69.02 11.94,69.02 12.24,68.71 12.85,68.71 13.31,68.26 13.31,65.67 13.61,65.36 14.68,65.36 15.44,64.6 15.44,63.68 17.88,61.25 v27.48,61.25
RB6  (via drill 0.35)
  Top 0.152: v100.33,41.28 92.71,33.66 92.25,33.66 88.75,30.16 88.75,26.5 88.59,26.35 84.48,26.35 81.89,23.76 81.89,21.93 80.97,21.01 80.97,19.18 74.72,12.94 54.61,12.94 54.15,12.48 54.15,11.72 v53.84,11.41
  Bottom 0.152: v100.33,41.28 100.33,44.18 101.09,44.94 101.09,45.55 100.02,46.62 99.26,46.62 99.11,46.77 99.11,48.29 98.8,48.6 97.28,48.6 90.57,55.3 90.57,65.06 88.29,67.34 88.29,70.69 87.07,71.91 87.07,74.2 86.61,74.66 81.73,74.66 79.6,76.79 79.6,78.01 80.52,78.92 81.28,78.92 81.89,78.31 82.5,78.31 84.78,76.03 96.52,76.03 98.35,77.86 R15.2 | v53.84,11.41 54.15,11.72 58.87,11.72 64.51,6.08 64.51,5.62 J1.05
RB7  (via drill 0.35)
  Top 0.152: v90.42,82.12 89.96,82.58 78.23,82.58 77.62,81.97 76.7,81.97 76.55,82.12 73.81,82.12 73.66,81.97 73.66,77.7 73.5,77.55 71.98,77.55 v71.68,77.25 | v84.48,41.59 84.02,41.59 67.1,24.67 67.1,19.49 J2.04
  Bottom 0.152: v90.42,82.12 92.86,79.69 92.86,79.08 93.93,78.01 R14.2 | v71.68,77.25 71.98,76.94 71.98,75.11 70.61,73.74 70.61,72.22 69.54,71.15 69.08,71.15 68.63,70.69 68.63,69.78 72.29,66.12 72.29,53.02 71.98,52.71 71.98,52.1 72.44,51.65 76.4,51.65 84.48,43.57 v84.48,41.59
RC0  (via drill 0.35)
  Top 0.152: v53.84,74.96 68.48,74.96 69.08,74.35 69.39,74.35 70,73.74 70.61,73.74 70.91,74.05 77.31,74.05 78.23,73.13 78.53,73.13 80.52,75.11 82.8,75.11 82.95,74.96 82.95,74.66 85.24,72.37 R12.1 | v47.29,81.52 46.99,81.21 33.27,81.21 30.83,83.65 10.56,83.65 10.26,83.95 9.65,83.95 1.27,75.57 1.27,24.36 6.14,19.49 J2.28
  Bottom 0.152: v47.29,81.52 v53.84,74.96
RC1
  Top 0.152: R11.1 80.82,72.22 80.82,64.45 73.5,57.13 62.23,57.13 46.99,41.89 46.38,41.89 46.07,42.2 46.07,62.47 46.38,62.77 46.38,63.23 45.92,63.68 45.92,64.6 45.62,64.9 45.62,65.51 45.92,65.82 45.92,66.43 45.01,67.34 35.1,67.34 33.73,65.97 19.4,65.97 18.03,64.6 18.03,63.68 17.73,63.38 17.73,46.31 18.18,45.85 18.18,45.7 21.38,42.5 21.38,41.89 20.93,41.43 20.93,40.67 11.02,30.77 11.02,22.08 8.73,19.79 8.73,19.49 J2.27
RC2  (via drill 0.35)
  Top 0.152: v73.96,56.67 62.23,56.67 47.14,41.59 45.46,41.59 v43.33,39.45 | v48.66,7.14 49.43,7.14 50.65,5.92 50.65,5.16 51.71,4.1 53.84,4.1 54.15,3.79 57.96,3.79 59.64,5.47 J1.07
  Bottom 0.152: v73.96,56.67 73.66,56.98 73.66,83.8 75.79,83.8 75.79,82.89 76.7,81.97 77.62,81.97 78.23,82.58 80.21,82.58 80.36,82.73 82.19,82.73 83.26,81.67 83.26,78.01 84.94,76.33 85.7,76.33 86.61,77.25 87.22,77.25 87.83,76.64 94.69,76.64 94.99,76.94 94.99,78.31 94.38,78.92 94.08,78.92 92.86,80.14 92.86,81.52 93.01,81.67 95.3,81.67 96.52,80.45 98.5,80.45 R10.1 | v43.33,39.45 43.63,39.15 43.63,22.23 42.41,21.01 41.65,21.01 40.59,19.95 40.59,19.03 41.65,17.96 45.01,17.96 45.16,17.81 45.16,12.48 45.46,12.17 47.44,12.17 47.6,12.02 48.36,12.02 48.97,11.41 48.97,7.45 v48.66,7.14
RC3  (via drill 0.35)
  Top 0.152: v93.32,74.35 93.01,74.66 93.01,78.31 94.08,79.38 94.08,80.3 R9.1 | v90.12,66.89 90.12,46.46 v91.03,45.55 | v91.03,41.13 91.03,36.41 91.64,35.8 91.64,33.97 88.14,30.46 88.14,30 87.07,28.94 86.15,28.94 84.33,27.11 84.33,26.65 81.58,23.91 81.58,22.08 80.67,21.16 80.67,19.34 74.57,13.24 54.45,13.24 53.84,12.63 53.84,12.33 53.24,11.72 v53.24,9.73
  Bottom 0.152: v93.32,74.35 93.32,74.5 93.16,74.66 88.44,74.66 87.37,73.59 87.37,72.07 90.12,69.32 v90.12,66.89 | v91.03,41.13 v91.03,45.55 | v53.24,9.73 56.89,6.08 56.89,5.62 J1.08
RC4
  Bottom 0.152: U1.2 30.22,81.67 31.59,81.67 38.6,74.66 38.6,74.05 38.76,73.89 38.76,66.73 40.89,64.6 40.89,63.68 39.67,62.47 38.91,62.47 38.76,62.31 38.76,47.23 44.7,41.28 44.7,20.71 45.46,19.95 45.46,19.03 45.31,18.88 45.31,18.12 45.46,17.96 45.46,12.63 45.62,12.48 47.6,12.48 47.75,12.33 48.51,12.33 49.27,11.56 49.27,5.62 J1.11
RD0
  Top 0.152: J1.20 26.57,5.62 26.57,12.33 26.72,12.48 26.87,12.48 27.79,13.39 27.79,17.96 27.94,18.12 27.94,18.88 27.63,19.18 27.63,19.95 27.48,20.1 27.48,20.86 27.63,21.01 27.63,40.98 26.87,41.74 26.87,63.99 LCD1.7
RD1
  Bottom 0.152: J1.21 23.98,5.62 23.98,15.22 27.63,18.88 27.63,19.95 27.48,20.1 27.48,20.86 27.79,21.16 27.79,41.43 29.46,43.11 29.46,63.99 LCD1.8
RD2
  Top 0.152: J1.22 21.54,5.47 21.54,5.16 22.6,4.1 26.72,4.1 27.63,5.01 27.63,6.08 26.87,6.84 26.87,12.17 27.02,12.17 28.09,13.24 28.09,16.9 30.22,19.03 30.22,41.74 32.05,43.57 32.05,63.99 LCD1.9
RD3
  Bottom 0.152: J1.23 18.95,5.47 18.95,5.16 20.01,4.1 24.13,4.1 25.19,5.16 25.19,6.08 24.28,6.99 24.28,12.17 27.02,12.17 27.48,12.63 32.51,12.63 32.81,12.94 32.81,17.96 32.51,18.27 32.51,18.73 32.97,19.18 32.97,19.95 34.03,21.01 34.8,21.01 34.95,21.16 34.95,41.89 35.41,42.35 35.41,64.14 34.64,64.14 LCD1.10
RD4
  Bottom 0.152: J1.14 41.65,5.62 40.89,5.62 40.89,11.87 39.98,12.78 37.39,12.78 37.23,12.94 35.71,12.94 35.71,16.9 37.84,19.03 37.84,19.95 36.78,21.01 35.86,21.01 35.71,21.16 35.71,41.13 36.17,41.59 36.17,64.14 36.93,64.14 LCD1.11
RD5
  Top 0.152: J2.18 31.44,19.49 30.68,19.49 30.68,33.97 38.6,41.89 39.37,41.89 39.67,42.2 39.67,63.99 LCD1.12
RD6
  Top 0.152: J2.17 34.03,19.49 34.03,19.95 32.51,21.47 32.05,21.47 31.9,21.62 31.9,34.73 38.76,41.59 39.52,41.59 39.98,42.04 39.98,62.77 41.2,63.99 42.11,63.99 LCD1.13
RD7
  Top 0.152: J2.16 36.62,19.49 36.62,19.79 35.41,21.01 34.64,21.01 34.49,21.16 34.49,36.86 38.91,41.28 41.81,41.28 42.41,41.89 42.41,42.5 42.57,42.65 42.57,62.77 43.79,63.99 44.55,63.99 LCD1.14
RE0
  Top 0.152: J2.26 11.33,19.49 11.33,30.61 21.23,40.52 21.23,41.28 21.69,41.74 21.69,42.65 18.49,45.85 18.49,46.01 18.34,46.16 18.34,64.14 19.25,64.14 LCD1.4
RE1
  Top 0.152: J2.25 13.76,19.49 13.76,19.79 12.54,21.01 11.78,21.01 11.63,21.16 11.63,30.46 21.54,40.37 21.54,41.13 21.99,41.59 21.99,42.81 19.71,45.09 19.71,60.18 23.52,63.99 24.28,63.99 LCD1.6
RE2  (via drill 0.35)
  Top 0.152: v71.37,57.74 71.68,57.44 73.35,57.44 80.52,64.6 80.52,71.3 79.6,72.22 79.6,73.29 80.82,74.5 82.19,74.5 83.72,72.98 83.72,71 84.02,70.69 86.46,70.69 87.37,71.61 87.37,75.72 89.51,77.86 R13.2 | v71.37,49.82 70.91,49.82 63.14,42.04 63.14,41.13 62.84,40.82 61.47,40.82 60.25,39.6 60.25,28.02 v60.55,27.72 | v54.76,21.93 53.84,21.01 51.71,21.01 50.65,19.95 50.65,19.03 50.8,18.88 50.8,18.42 50.49,18.12 50.49,12.78 50.34,12.63 31.9,12.63 31.59,12.33 31.59,5.62 J1.18
  Bottom 0.152: v71.37,57.74 71.68,57.44 71.68,53.32 71.37,53.02 v71.37,49.82 | v54.76,21.93 v60.55,27.72
RE3  (via drill 0.35)
  Top 0.152: v109.47,55.45 109.01,55.45 108.56,55 v104.44,55 | v91.64,49.51 v94.54,52.41 | v85.7,41.43 85.24,41.43 84.78,40.98 83.87,40.98 67.41,24.52 67.41,22.08 69.54,19.95 69.54,19.49 J2.03
  Bottom 0.152: v109.47,55.45 110.08,56.06 115.26,56.06 115.42,56.22 115.42,61.09 DS1.9 | v104.44,55 103.98,55.45 99.26,55.45 99.11,55.3 98.8,55.3 98.65,55.45 97.58,55.45 v94.54,52.41 | v91.64,49.51 88.59,46.46 88.59,44.33 v85.7,41.43
RF0  (via drill 0.35)
  Top 0.152: v90.88,35.64 86.76,35.64 SW1.1 | 115.87,34.27 116.18,34.27 117.4,35.49 SW4.1 | 115.87,34.27 112.98,34.27 111.76,35.49 107.8,35.49 SW3.1 | 43.63,12.17 45.62,12.17 45.62,10.34 47.29,8.67 50.49,8.67 53.24,5.92 53.24,5.16 54.3,4.1 54.61,4.1 55.67,5.16 55.67,6.08 54.76,6.99 54.76,12.17 69.69,12.17 69.69,5.62 J1.03 | 43.63,12.17 31.9,12.17 31.9,6.99 32.81,6.08 32.81,5.16 31.44,3.79 22.91,3.79 21.99,2.88 21.08,2.88 20.93,3.03 19.55,3.03 19.4,2.88 18.49,2.88 18.34,3.03 17.12,3.03 16.96,2.88 16.05,2.88 13.92,5.01 13.92,5.47 J1.25 | v115.87,27.26 115.87,34.27 | v50.03,41.13 50.03,40.98 50.19,40.82 50.19,21.93 48.05,19.79 48.05,19.03 44.85,15.83 44.24,15.83 43.79,15.37 v43.33,15.37 | 43.63,12.17 v43.63,11.72
  Bottom 0.152: v90.88,35.64 92.1,34.42 96.36,34.42 97.58,35.64 SW2.1 | v115.87,27.26 115.87,26.8 116.48,26.19 116.48,25.43 116.63,25.28 116.63,21.62 116.79,21.47 116.79,21.01 116.33,20.55 116.33,9.28 116.18,9.12 110.23,9.12 109.93,8.82 103.53,8.82 100.48,11.87 75.79,11.87 69.54,5.62 J1.03 | v50.03,41.13 49.73,40.82 49.73,21.47 49.88,21.32 62.38,21.32 69.24,28.18 69.24,36.71 69.54,37.01 70,37.01 73.35,33.66 84.33,33.66 86.31,35.64 86.61,35.64 SW1.1 | v43.33,15.37 43.33,12.02 v43.63,11.72
RF1  (via drill 0.35)
  Top 0.152: v105.2,42.2 103.53,42.2 102,43.72 102,44.18 101.7,44.48 101.09,44.48 100.78,44.18 100.78,43.72 94.23,37.17 92.1,37.17 91.94,37.01 91.94,33.81 88.44,30.31 88.44,28.79 87.37,27.72 SW5.1 | SW8.1 117.85,27.57 116.94,26.65 114.96,26.65 114.65,26.35 109.32,26.35 108.1,27.57 SW7.1 | v11.33,3.49 12.39,2.42 23.36,2.42 23.98,1.81 63.6,1.81 | 63.6,1.81 67.26,5.47 J1.04 | v75.79,3.18 75.49,2.88 71.98,2.88 70.91,1.81 63.6,1.81
  Bottom 0.152: v105.2,42.2 105.81,41.59 105.81,29.85 | 105.81,29.85 107.95,27.72 SW7.1 | 105.81,29.85 101.55,29.85 100.48,28.79 99.41,28.79 98.35,27.72 SW6.1 | v11.33,3.49 11.33,5.47 J1.26 | v75.79,3.18 77.47,1.5 85.7,1.5 93.32,9.12 93.32,10.65 94.23,11.56 100.33,11.56 103.38,8.52 110.08,8.52 110.39,8.82 116.33,8.82 116.63,9.12 116.63,20.4 117.24,21.01 118.31,21.01 119.22,21.93 119.22,24.36 118.01,25.58 118.01,27.57 SW8.1
RF2
  Top 0.152: 107.34,18.57 106.12,17.36 101.85,17.36 101.7,17.2 101.09,17.2 98.65,19.64 SW10.1 98.5,19.49 97.28,18.27 93.01,18.27 91.79,19.49 87.83,19.49 SW9.1 87.68,19.49 80.36,12.17 76.55,12.17 76.4,12.02 76.4,2.88 76.1,2.57 72.13,2.57 71.07,1.5 23.82,1.5 23.21,2.12 10.56,2.12 8.73,3.94 8.73,5.47 J1.27 | 107.34,18.57 108.25,19.49 SW11.1 | 107.34,18.57 109.47,18.57 111,17.05 111.61,17.05 111.91,17.36 116.02,17.36 118.16,19.49 SW12.1
RF3  (via drill 0.35)
  Top 0.152: SW16.1 88.29,10.5 92.1,10.5 93.47,9.12 96.97,9.12 98.35,10.5 SW15.1 98.5,10.65 99.72,11.87 106.12,11.87 107.34,10.65 108.4,10.65 SW14.1 108.56,10.65 109.78,11.87 116.18,11.87 117.4,10.65 118.61,10.65 SW13.1 | v17.12,4.1 16.2,4.1 15.14,5.16 15.14,5.92 14.22,6.84 13.46,6.84 12.54,5.92 12.54,5.16 11.48,4.1 11.02,4.1 10.11,5.01 10.11,5.92 9.19,6.84 8.28,6.84 7.06,5.62 6.3,5.62 J1.28
  Bottom 0.152: v17.12,4.1 17.12,3.64 19.25,1.5 73.2,1.5 83.26,11.56 87.22,11.56 88.14,10.65 SW16.1
RF4  (via drill 0.35)
  Top 0.152: SW9.2 95.91,19.64 97.28,21.01 99.72,21.01 99.87,20.86 99.87,18.88 101.24,17.51 101.55,17.51 101.85,17.81 106.12,17.81 106.42,18.12 106.42,24.06 108.4,26.04 114.81,26.04 115.11,26.35 120.6,26.35 123.19,28.94 125.63,28.94 127.76,26.8 127.76,13.09 125.32,10.65 SW13.2 | v107.34,69.02 107.19,69.17 107.19,70.85 106.73,71.3 106.73,78.31 108.56,80.14 R22.1 | v105.66,68.41 105.81,68.41 105.97,68.26 105.97,65.36 104.75,64.14 104.75,63.23 103.83,62.31 v103.83,52.86 | 100.02,42.5 93.32,35.8 SW1.2 | 100.02,42.5 v101.39,43.87 103.38,41.89 104.59,41.89 v105.2,41.28 | 100.02,42.5 100.94,41.59 100.94,40.98 100.63,40.67 100.17,40.67 94.54,35.03 94.54,30 93.93,29.39 93.93,27.72 SW5.2 | v25.04,20.4 24.74,20.71 20.93,20.71 19.71,19.49 18.95,19.49 J2.23 | v28.85,61.7 30.68,63.53 30.68,64.45 31.9,65.67 33.88,65.67 34.64,66.43 44.24,66.43 v44.55,66.73 | v46.99,66.73 47.29,66.43 47.29,65.67 47.6,65.36 47.75,65.36 48.51,64.6 48.51,63.68 49.43,62.77 50.34,62.77 51.1,63.53 v51.25,63.53 | v72.29,33.2 v72.29,42.5
  Bottom 0.152: v107.34,69.02 106.27,69.02 v105.66,68.41 | v103.83,52.86 103.83,49.05 101.39,46.62 v101.39,43.87 | v25.04,20.4 24.28,21.16 24.28,57.13 v28.85,61.7 | v46.99,66.73 v44.55,66.73 | v72.29,42.5 v51.25,63.53 | v72.29,33.2 72.74,33.2 73.05,32.9 86.31,32.9 86.46,33.05 88.14,33.05 93.47,27.72 93.77,27.72 SW5.2 | v105.2,41.28 105.51,40.98 105.51,34.58 105.36,34.42 104.75,34.42 101.24,30.92 101.24,30 100.33,29.09 97.43,29.09 97.28,28.94 96.97,28.94 96.36,28.33 96.36,25.43 95.91,24.98 91.03,24.98 91.03,21.93 93.32,19.64 94.08,19.64 SW9.2
RF5  (via drill 0.35)
  Top 0.152: v108.25,55.61 108.56,55.91 108.56,63.53 106.73,65.36 106.73,69.32 106.88,69.48 106.88,70.69 106.42,71.15 106.42,82.58 107.8,83.95 111.45,83.95 112.67,85.17 112.67,87.46 112.52,87.46 112.37,87.31 108.4,87.31 107.03,88.68 107.03,90.96 107.49,91.42 111.3,91.42 111.45,91.27 111.45,89.75 113.43,87.76 113.43,82.89 113.59,82.73 113.59,80.3 116.02,80.3 R23.1 | v102.61,44.02 103.53,44.02 103.83,43.72 104.29,43.72 v104.9,43.11 | SW10.2 105.2,19.64 106.12,20.55 106.12,24.36 104.75,25.74 104.75,27.57 SW6.2 104.59,27.72 101.24,31.07 101.24,33.2 103.68,35.64 103.98,35.64 SW2.2
  Bottom 0.152: v108.25,55.61 108.25,55 108.4,54.84 108.4,53.02 104.29,48.9 104.14,48.9 101.7,46.46 101.7,44.94 v102.61,44.02 | v104.9,43.11 104.59,42.81 104.59,36.25 104.14,35.8 SW2.2 | 103.53,9.28 103.68,9.12 109.78,9.12 110.08,9.43 113.89,9.43 114.96,10.5 SW14.2 | 103.53,9.28 103.53,17.96 105.05,19.49 SW10.2 | 103.53,9.28 100.63,12.17 75.64,12.17 75.49,12.02 53.08,12.02 52.32,11.26 52.32,6.84 53.08,6.08 53.08,5.16 50.95,3.03 50.95,2.27 50.49,1.81 19.4,1.81 17.88,3.33 17.88,4.86 17.73,5.01 17.73,6.08 21.38,9.73 21.38,19.34 J2.22
RF6  (via drill 0.35)
  Top 0.152: v9.65,2.12 10.11,2.12 10.41,1.81 23.06,1.81 23.67,1.2 96.06,1.2 104.75,9.89 104.75,10.5 SW15.2
  Bottom 0.152: R24.1 123.49,80.14 127.76,75.88 127.76,44.79 119.99,37.01 115.57,37.01 114.2,35.64 SW3.2 114.2,35.49 114.2,33.66 115.57,32.29 115.57,28.63 114.65,27.72 SW7.2 114.65,27.57 116.18,26.04 116.18,25.28 116.33,25.13 116.33,21.01 114.96,19.64 SW11.2 114.96,19.49 106.12,10.65 104.9,10.65 SW15.2 | v9.65,2.12 9.8,2.27 9.8,5.01 9.95,5.16 9.95,5.92 10.87,6.84 10.87,12.33 17.57,19.03 17.57,19.79 19.1,21.32 21.69,21.32 23.52,19.49 23.82,19.49 J2.21
RF7  (via drill 0.35)
  Top 0.152: v106.27,91.73 111.45,91.73 111.76,91.42 111.76,89.9 114.35,87.31 116.02,87.31 116.18,87.15 118.16,87.15 120.14,85.17 120.14,82.58 120.29,82.43 120.29,76.03 118.61,74.35 115.87,74.35 R25.1 | v93.01,91.88 93.01,95.08 93.16,95.23 94.99,95.23 96.52,96.75 125.93,96.75 127.76,94.93 127.76,39.3 124.1,35.64 SW4.2 | SW16.2 94.84,10.65 95.91,10.65 97.13,11.87 99.26,11.87 99.56,12.17 117.85,12.17 124.71,19.03 124.71,19.49 SW12.2 124.86,19.64 125.78,20.55 125.78,24.36 124.41,25.74 124.41,27.57 SW8.2
  Bottom 0.152: v106.27,91.73 105.05,92.94 101.24,92.94 99.87,91.57 93.32,91.57 v93.01,91.88 | SW8.2 124.25,27.72 123.49,27.72 121.21,30 121.21,32.75 123.95,35.49 SW4.2 | J2.20 26.41,19.34 26.41,19.03 25.35,17.96 23.82,17.96 22.6,19.18 22.6,19.95 21.54,21.01 21.23,21.01 20.16,19.95 20.16,19.03 21.08,18.12 21.08,9.89 18.34,7.14 16.2,7.14 15.14,6.08 15.14,5.16 19.1,1.2 85.85,1.2 93.62,8.97 93.62,9.43 94.69,10.5 SW16.2
V0
  Top 0.152: R26.2 7.06,75.88 9.5,75.88 10.72,77.1 11.17,77.1 14.98,73.29 14.98,71.46 17.57,68.87 17.57,64.14 16.81,64.14 LCD1.3
VBUS
  Top 0.152: R26.1 4.47,73.29 6.91,73.29 7.21,72.98 7.52,72.98 8.43,72.07 11.48,72.07 12.54,73.13 R27.1 12.7,73.13 14.37,71.46 14.37,69.32 14.22,69.17 14.22,64.14 LCD1.2
  Bottom 0.152: J2.01 74.72,19.34 71.07,15.68 71.07,13.54 70.3,12.78 52.02,12.78 51.56,12.33 51.56,6.84 50.65,5.92 50.65,5.16 50.8,5.01 50.8,3.33 50.65,3.18 50.65,2.42 50.49,2.27 40.89,2.27 37.84,5.32 37.84,6.08 37.08,6.84 37.08,12.17 36.78,12.48 35.41,12.48 35.25,12.63 35.25,17.81 35.56,18.12 35.56,18.88 35.41,19.03 35.41,19.95 35.56,20.1 35.56,20.86 35.25,21.16 35.25,41.74 35.71,42.2 35.71,64.6 35.56,64.75 35.56,66.43 35.71,66.58 35.71,71.76 35.41,72.07 34.34,72.07 33.73,71.46 14.37,71.46 12.7,73.13 R27.1
VTG  (via drill 0.35)
  Top 0.152: LED3.A 113.13,45.4 114.35,46.62 116.79,46.62 118.01,45.4 LED2.A 118.16,45.4 119.38,46.62 121.97,46.62 123.19,45.4 LED1.A | J2.06 62.08,19.49 62.08,20.1 87.22,45.24 LED8.A 87.37,45.24 87.68,45.24 88.75,44.18 91.34,44.18 92.4,45.24 LED7.A 92.56,45.24 93.62,44.18 96.06,44.18 97.13,45.24 97.43,45.24 LED6.A 97.58,45.4 98.8,46.62 101.39,46.62 102.61,45.4 LED5.A 102.77,45.24 103.98,44.02 v104.9,44.02 | R25.2 110.23,74.2 112.67,74.2 112.67,77.25 112.82,77.4 112.82,80.3 110.54,80.3 R23.2 | v31.44,80.91 31.44,80.6 48.21,80.6 48.36,80.45 48.36,77.4 52.02,73.74 68.17,73.74 68.17,71.61 68.32,71.46 70.76,71.46 70.91,71.61 70.91,73.59 71.07,73.74 72.59,73.74 | 72.59,73.74 77.16,73.74 77.16,72.83 IC1.10 | v83.87,76.03 83.56,76.03 83.11,75.57 79.75,75.57 v78.99,74.81 | 72.59,73.74 v72.59,73.44
  Bottom 0.152: LED3.A 112.98,45.4 111.76,46.62 109.17,46.62 107.95,45.4 LED4.A 107.8,45.24 107.49,45.24 106.27,44.02 v104.9,44.02 | 105.51,80.3 103.07,80.3 R22.2 | 105.51,80.3 105.51,84.72 107.34,86.54 110.23,86.54 110.39,86.39 | 110.39,86.39 111.3,85.48 111.3,84.87 110.69,84.26 110.69,80.45 110.54,80.3 R23.2 | 110.39,86.39 110.69,86.7 116.02,86.7 116.18,86.54 118.77,86.54 118.92,86.39 118.92,85.17 118.01,84.26 118.01,82.58 117.85,82.43 117.85,80.3 R24.2 | v31.44,80.91 31.44,80.3 30.22,79.08 U1.1 | 105.51,80.3 105.51,77.4 103.98,75.88 101.85,75.88 101.7,75.72 84.17,75.72 v83.87,76.03 | v78.99,74.81 77.01,72.83 IC1.10 | v72.59,73.44 72.89,73.13 72.89,55.61 83.11,45.4 87.22,45.4 LED8.A